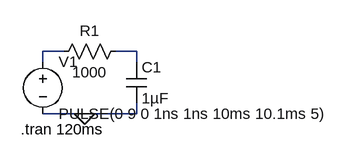
[diagram p0: schematic Draft2.asc]
Draft2.asc, the LTspice schematic file:
Version 4
SHEET 1 880 680
WIRE 128 80 96 80
WIRE 240 80 208 80
WIRE 96 96 96 80
WIRE 240 96 240 80
WIRE 160 176 96 176
WIRE 240 176 240 160
WIRE 240 176 160 176
FLAG 160 176 0
SYMBOL res 224 64 R90
WINDOW 0 0 56 VBottom 2
WINDOW 3 32 56 VTop 2
SYMATTR InstName R1
SYMATTR Value 1000
SYMBOL cap 224 96 R0
SYMATTR InstName C1
SYMATTR Value 1µF
SYMBOL voltage 96 80 R0
WINDOW 123 0 0 Left 2
WINDOW 39 0 0 Left 2
SYMATTR InstName V1
SYMATTR Value PULSE(0 9 0 1ns 1ns 10ms 10.1ms 5)
TEXT 62 200 Left 2 !.tran 120ms

The netlist it stands for:
* Draft2.asc
R1 N002 N001 1000
C1 N002 0 1µF
V1 N001 0 PULSE(0 9 0 1ns 1ns 10ms 10.1ms 5)
.tran 120ms
.backanno
.end